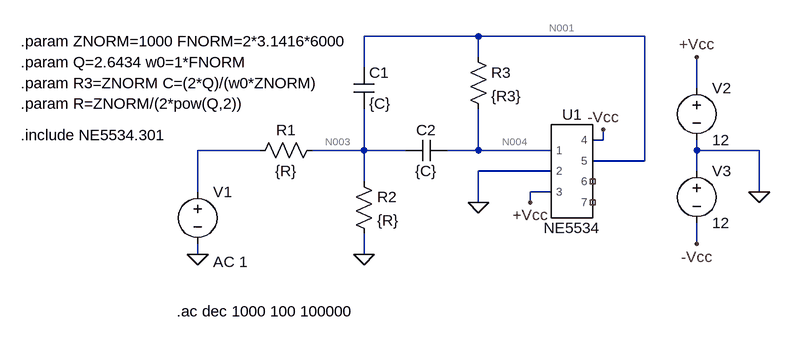
[diagram p0: schematic tplab1tc2.asc]
tplab1tc2.asc, the LTspice schematic file:
Version 4.1
SHEET 1 880 680
WIRE 288 -32 112 -32
WIRE 544 -32 288 -32
WIRE 288 0 288 -32
WIRE 112 16 112 -32
WIRE 624 48 624 0
WIRE 480 128 480 112
WIRE 480 128 464 128
WIRE -48 144 -144 144
WIRE 112 144 112 80
WIRE 112 144 32 144
WIRE 176 144 112 144
WIRE 288 144 288 80
WIRE 288 144 240 144
WIRE 400 144 288 144
WIRE 624 144 624 128
WIRE 720 144 624 144
WIRE 544 160 544 -32
WIRE 544 160 464 160
WIRE 400 176 288 176
WIRE 624 176 624 144
WIRE 112 192 112 144
WIRE -144 208 -144 144
WIRE 400 208 368 208
WIRE 720 208 720 144
WIRE 288 224 288 176
WIRE 368 224 368 208
WIRE 624 288 624 256
WIRE -144 304 -144 288
WIRE 112 304 112 272
FLAG 288 224 0
FLAG 112 304 0
FLAG -144 304 0
FLAG 720 208 0
FLAG 624 0 +Vcc
FLAG 368 224 +Vcc
FLAG 624 288 -Vcc
FLAG 480 112 -Vcc
DATAFLAG 544 144 ""
SYMBOL res 48 128 R90
WINDOW 0 0 56 VBottom 2
WINDOW 3 32 56 VTop 2
SYMATTR InstName R1
SYMATTR Value {R}
SYMBOL res 96 176 R0
SYMATTR InstName R2
SYMATTR Value {R}
SYMBOL res 272 -16 R0
SYMATTR InstName R3
SYMATTR Value {R3}
SYMBOL cap 96 16 R0
SYMATTR InstName C1
SYMATTR Value {C}
SYMBOL cap 240 128 R90
WINDOW 0 0 32 VBottom 2
WINDOW 3 32 32 VTop 2
SYMATTR InstName C2
SYMATTR Value {C}
SYMBOL voltage -144 192 R0
WINDOW 123 24 124 Left 2
WINDOW 39 0 0 Left 0
SYMATTR Value2 AC 1
SYMATTR InstName V1
SYMATTR Value ""
SYMBOL voltage 624 32 R0
WINDOW 123 0 0 Left 0
WINDOW 39 0 0 Left 0
SYMATTR InstName V2
SYMATTR Value 12
SYMBOL voltage 624 160 R0
WINDOW 123 0 0 Left 0
WINDOW 39 0 0 Left 0
SYMATTR InstName V3
SYMATTR Value 12
SYMBOL NE5534 432 176 R0
SYMATTR InstName U1
TEXT -416 8 Left 2 !.param Q=2.6434 w0=1*FNORM
TEXT -176 392 Left 2 !.ac dec 1000 100 100000
TEXT -416 -24 Left 2 !.param ZNORM=1000 FNORM=2*3.1416*6000
TEXT -416 40 Left 2 !.param R3=ZNORM C=(2*Q)/(w0*ZNORM)
TEXT -416 72 Left 2 !.param R=ZNORM/(2*pow(Q,2))
TEXT -416 120 Left 2 !.include NE5534.301

The netlist it stands for:
* tplab1tc2.asc
R1 N003 N002 {R}
R2 N003 0 {R}
R3 N001 N004 {R3}
C1 N001 N003 {C}
C2 N004 N003 {C}
V1 N002 0 AC 1
V2 +Vcc 0 12
V3 0 -Vcc 12
X§U1 N004 0 +Vcc -Vcc N001 NC_01 NC_02 NE5534  ; pins 1 2 3 4 5 6 7
.param Q=2.6434 w0=1*FNORM
.ac dec 1000 100 100000
.param ZNORM=1000 FNORM=2*3.1416*6000
.param R3=ZNORM C=(2*Q)/(w0*ZNORM)
.param R=ZNORM/(2*pow(Q,2))
.include NE5534.301
.lib C:\users\julian\Documents\uni\tc2\repositorio\tp_lab_1\sim\NE5534.301
.backanno
.end

* Results of the author's LTspice run, read from the files saved beside the schematic
* Operating Point, zero values left out:
*   V(+vcc) = 12 V
*   V(-vcc) = -12 V
*   V(n001) = 491.5 µV
*   V(n004) = -6.726 µV
*   I(R3) = 498.3 nA
*   I(V2) = -3.226 mA
*   I(V3) = -3.227 mA
*   Ix(u1:1) = 498.3 nA
*   Ix(u1:2) = 498.3 nA
*   Ix(u1:3) = 3.226 mA
*   Ix(u1:4) = -3.227 mA
*   Ix(u1:5) = -498.3 nA
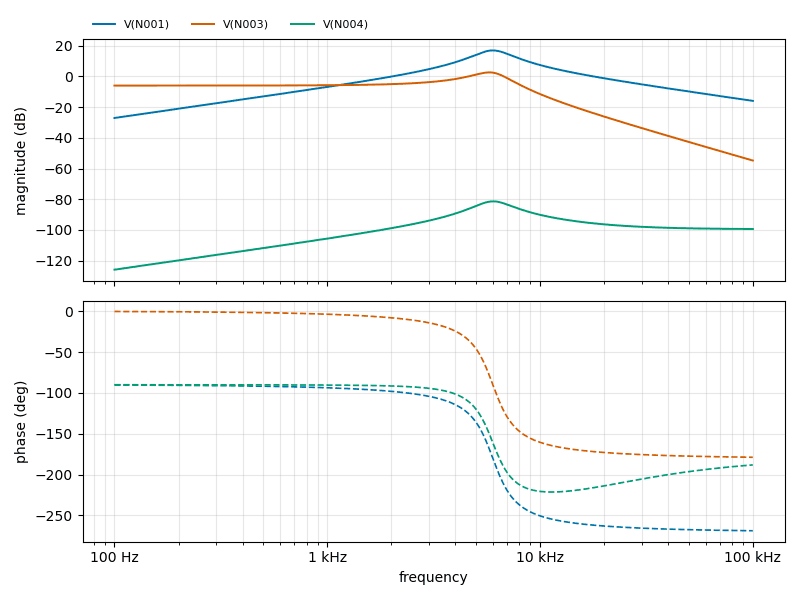
[diagram p1: AC Analysis of tplab1tc2.asc, plotted from the saved traces]
* AC Analysis, 1 run:
*   V(N001): -27.12 dB at 100 Hz, -15.96 dB at 100 kHz, peak 16.89 dB at 5.998 kHz, 3 dB below the peak at 4.972 kHz and 7.241 kHz
*   V(N003): -6.02 dB at 100 Hz, -54.81 dB at 100 kHz, peak 2.58 dB at 5.781 kHz, 3 dB below the peak at 4.478 kHz and 6.841 kHz
*   V(N004): -125.88 dB at 100 Hz, -99.39 dB at 100 kHz, peak -81.38 dB at 6.026 kHz, 3 dB below the peak at 5.003 kHz and 7.309 kHz